# Altium schematic sheet [4]Signal_ports(USART&ST-link&Encoder).SchDoc
size A; PageSetup: Record=PageOptions|CenterHorizontal=True|CenterVertical=True|PrintScale=1.00|XCorrection=1.00|YCorrection=1.00|PrintKind=1|BorderSize=5000000|LeftOffset=0|BottomOffset=0|Orientation=1|PaperLength=1000|PaperWidth=1000|Scale=100|PaperSource=7|PrintQuality=-3|MediaType=1|DitherType=10|PrintScaleMode=1|PaperKind=A4|PaperIndex=9
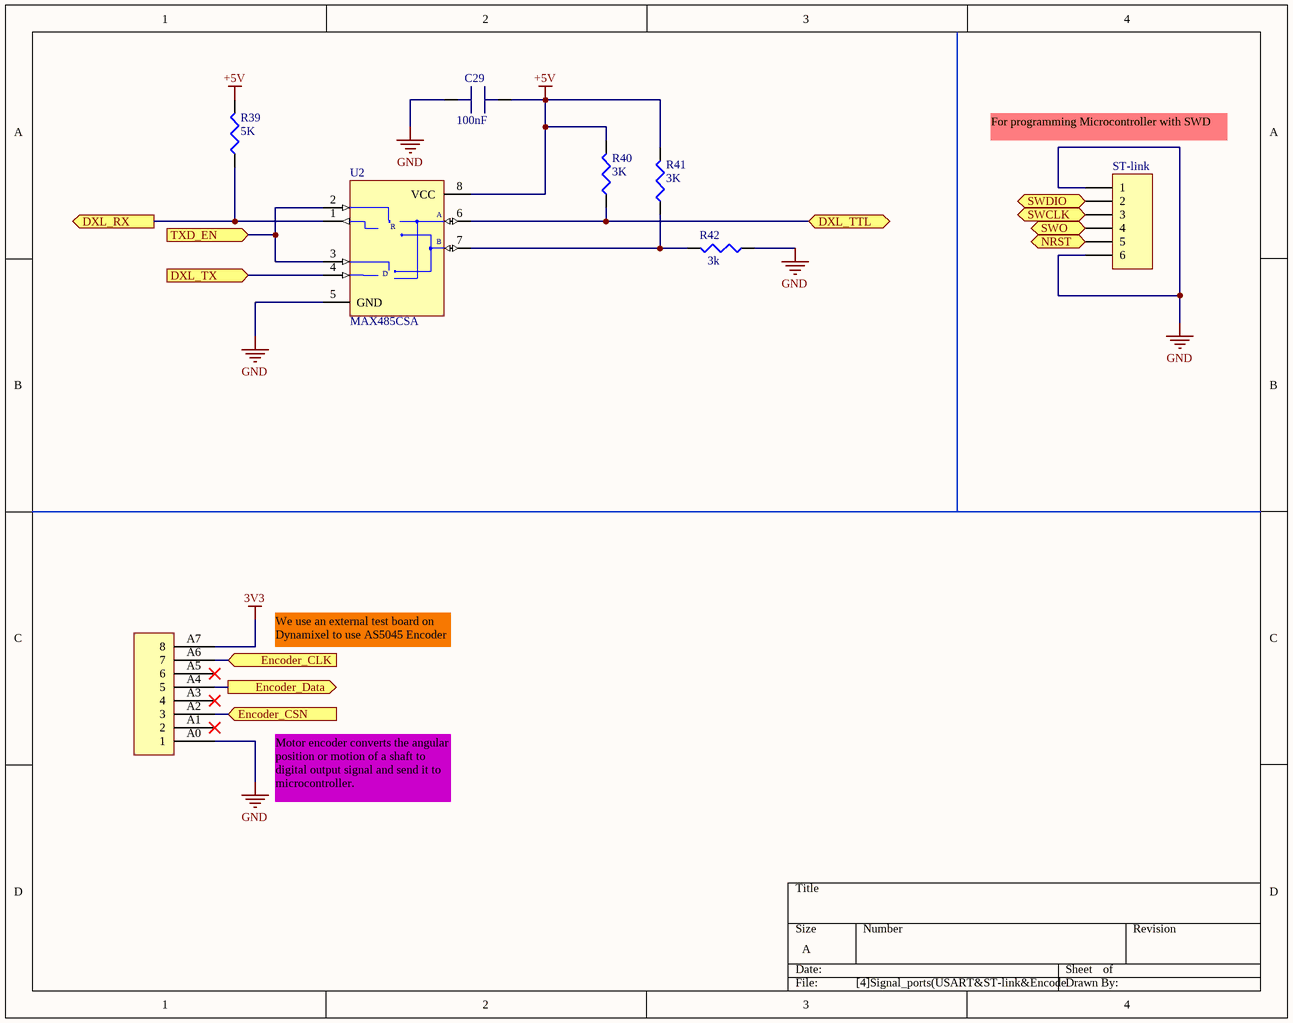
[diagram p0: [4]Signal_ports(USART&ST-link&Encoder).SchDoc]

## Parts
C29  100nF  [cap_805]
DXL_Encoder  pinheader 8  [PinHeader Female 8]  (value not drawn)
R39  5K  [Res805]
R40  3K  [Res805]
R41  3K  [Res805]
R42  3k  [Res805]
ST-link  Molex 22-03-5065  [Molex 22-03-5065]  (value not drawn)
U2  MAX485CSA  [NSO8_N]

## Ports
DXL_RX (out), DXL_TTL (bidir), DXL_TX (in), Encoder_CLK (in), Encoder_CSN (in), Encoder_Data (out), NRST (out), SWCLK, SWDIO (bidir), SWO (bidir), TXD_EN (in)

## Nets
3V3: DXL_Encoder.A7(8)
+5V: C29.2 R39.2 R40.2 R41.2 U2.8(VCC)
GND: C29.1 DXL_Encoder.A0(1) R42.1 ST-link.1 ST-link.6 U2.5(GND)
DXL_RX: R39.1 U2.1(RO) ; port DXL_RX
DXL_TTL: R40.1 U2.6(A) ; port DXL_TTL
DXL_TX: U2.4(DI) ; port DXL_TX
Encoder_CLK: DXL_Encoder.A6(7) ; port Encoder_CLK
Encoder_CSN: DXL_Encoder.A2(3) ; port Encoder_CSN
Encoder_Data: DXL_Encoder.A4(5) ; port Encoder_Data
NRST: ST-link.5 ; port NRST
SWCLK: ST-link.3 ; port SWCLK
SWDIO: ST-link.2 ; port SWDIO
SWO: ST-link.4 ; port SWO
TXD_EN: U2.2(~{RE}) U2.3(DE) ; port TXD_EN
NetR41_1: R41.1 R42.2 U2.7(B)

Not connected (* = marked no-connect by the designer): DXL_Encoder A1(2)* A3(4)* A5(6)*

## Notes on the sheet
- (near ST-link) For programming Microcontroller with SWD
- We use an external test board on Dynamixel to use AS5045 Encoder
- Motor encoder converts the angular position or motion of a shaft to digital output signal and send it to microcontroller.
- (in symbol MAX485CSA) R; D

## Library data of the parts
C29 = cap805
R39-R42 = Res805
U2 = MAX485CSA: Low-Power, Slew-Rate-Limited RS-485/RS-422 Transceiver; Published: 16-Jan-2001; LatestRevisionDate: 13-Apr-2006; LatestRevisionNote: IPC-7351 Footprint Added.; DatasheetVersion: Feb-1996; PackageReference: NSO8; Publisher: Altium Limited; PackageDescription: 8-Pin Small Outline Integrated Circuit 1.27 mm Pitch; Code_JEDEC: MS-012-AA; Code_IPC: SOIC127P600-8; ComponentLink1Description: Manufacturer Link; ComponentLink1URL: http://www.maxim-ic.com/; ComponentLink2Description: Datasheet; ComponentLink2URL: http://pdfserv.maxim-ic.com/en/ds/MAX1487-MAX491.pdf